# EAGLE design Blinkenlights (EAGLE 6.4)
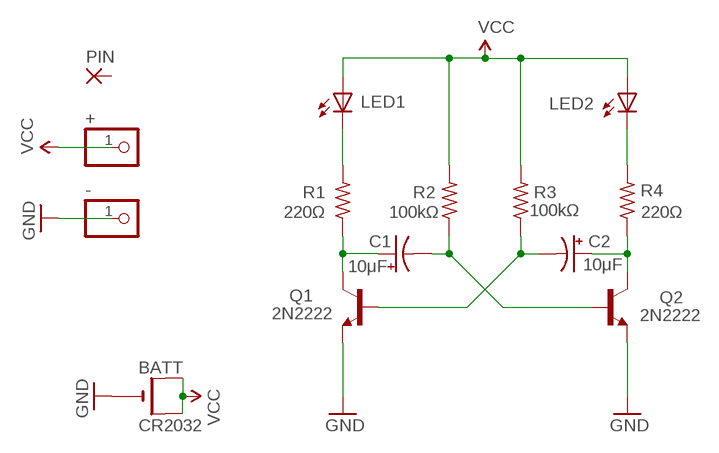
[diagram p0: schematic, sheet 1]

## Parts
+  PINHD-1X1CB  [1X01-CLEANBIG]
-  PINHD-1X1CB  [1X01-CLEANBIG]
BATT  CR2032  CR2032SMT  [CR2032-SMD]
C1  10μF  CAP-POL_E-2.54-05  [E-2.54-05]
C2  10μF  CAP-POL_E-2.54-05  [E-2.54-05]
LED1  LED5MM_BIG  [LED5MM_BIG]
LED2  LED5MM_BIG  [LED5MM_BIG]
PIN  3,17/1,3  [3,17/1,3]
Q1  2N2222  [TO92-EBC-OVAL]
Q2  2N2222  [TO92-EBC-OVAL]
R1  220Ω  RESISTOR-0207/10_BIG  [0207/10_BIG]
R2  100kΩ  RESISTOR-0207/10_BIG  [0207/10_BIG]
R3  100kΩ  RESISTOR-0207/10_BIG  [0207/10_BIG]
R4  220Ω  RESISTOR-0207/10_BIG  [0207/10_BIG]

## Nets
GND: -.1 BATT.- Q1.E Q2.E
N$1: C1.+ Q1.C R1.1
N$2: C2.+ Q2.C R4.1
N$3: C1.- Q2.B R2.1
N$4: C2.- Q1.B R3.1
N$5: LED1.K(C) R1.2
N$6: LED2.K(C) R4.2
VCC: +.1 BATT.+$1(+) BATT.+$2(+1) LED1.A LED2.A R2.2 R3.2
Unconnected: PIN.1(P)

## Library data of the parts
+ - = IXR:PINHD-1X1: Pin header 1x1 for 0.1" spacing With round pins
BATT = adafruit:CR2032
C1 C2 = IXR:CAP-POL: Polarized Capacitor
LED1 LED2 = IXR:LED: LED
PIN = wirepad:3,17/1,3: THROUGH-HOLE PAD
Q1 Q2 = IXR:2N2222: NPN TRANSISTOR Big oval pads
R1-R4 = IXR:RESISTOR: RESISTOR

## Net classes
0 default: width 0.254 mm, clearance 0.254 mm

## Board
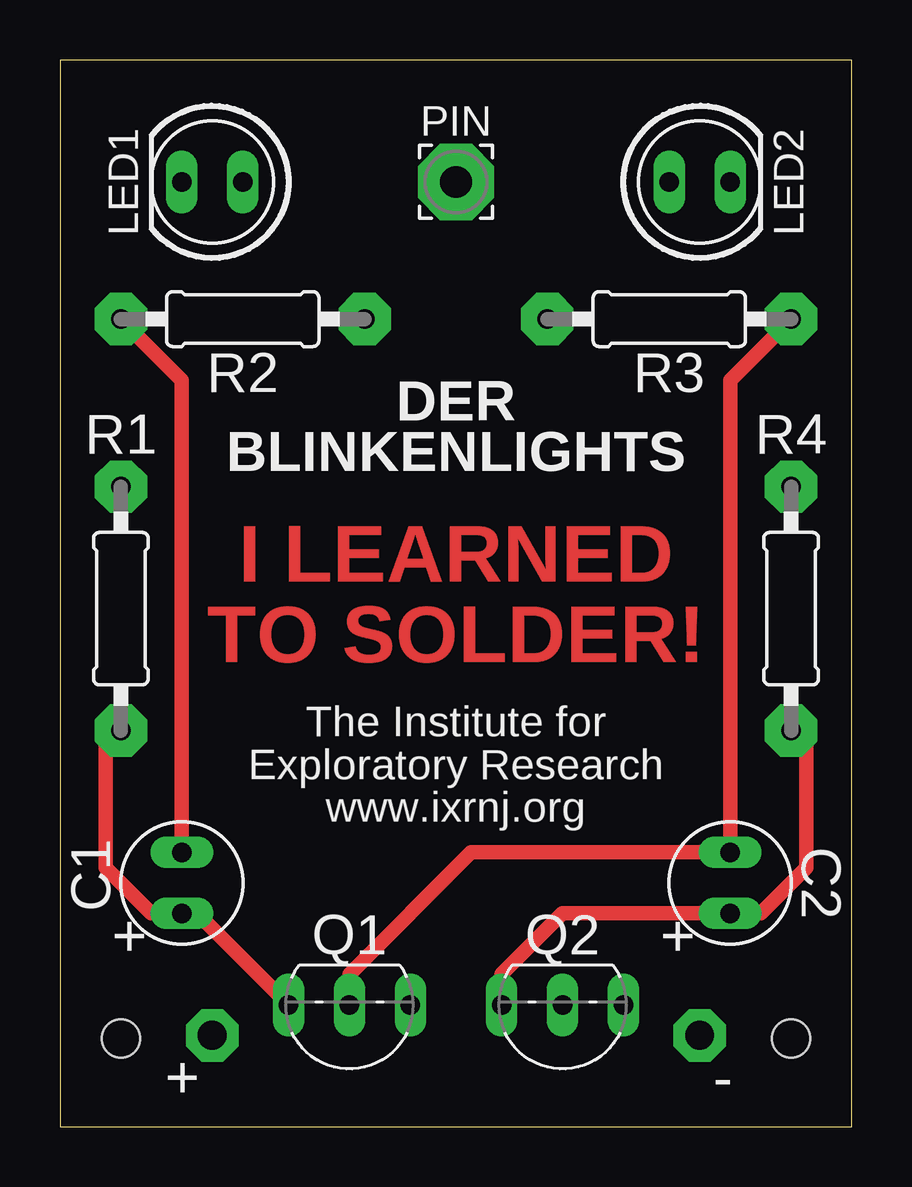
[diagram p1: board, top side]
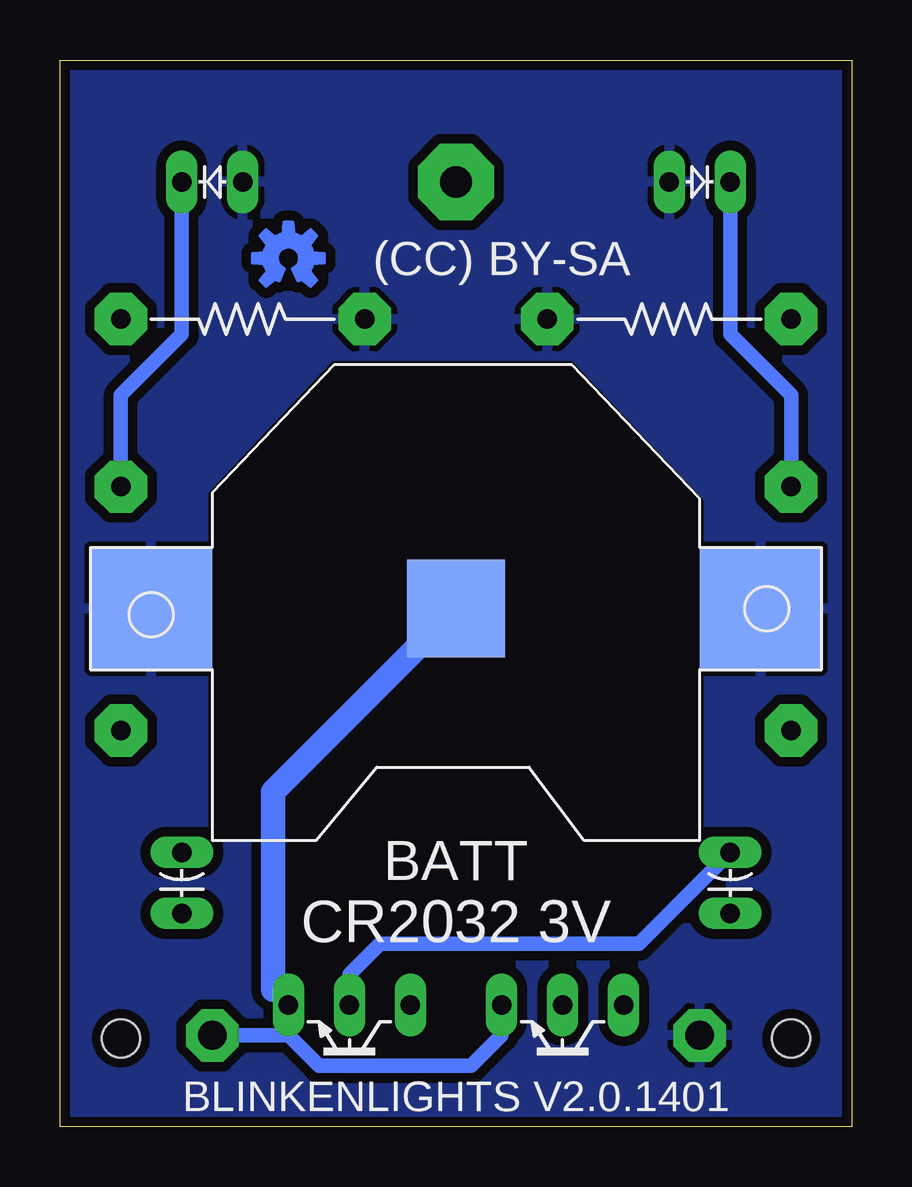
[diagram p2: board, bottom side, seen from below]

Size 33.02 x 44.45 mm. Coordinates in mm from the lower left corner, seen from the top.
Outline: 0,0 33.02,0 33.02,44.45 0,44.45 0,0
Copper layers (1*16): Top 0.035mm / dielectric 1.5mm / Bottom 0.035mm
Design rules "Fusion_eagle_rule_v1.1": minimum track width 6mil, minimum drill 12mil, track to track 6mil, track to pad 6mil, pad to pad 6mil, via to via 6mil, smd to smd 0mil, copper to edge 10mil, drill to drill 10mil, minimum pad ring 10mil, minimum via ring 6mil, stop-mask expansion 2mil, vias tented up to drill 100mil, thermal gap 10mil
Holes 1.6 mm at 2.54,3.68 30.48,3.68

### Footprints (pad centres in the part's own frame; a part is rotated, then mirrored left to right if it is on the bottom)
1X01-CLEANBIG = drill 1.2 pad 2.184 octagon: 1 0,0
CR2032-SMD = smd 5.08 x 5.08: +$1 -12.7,0; +$2 12.7,0 | smd 4.064 x 4.064: - 0,0
E-2.54-05 = drill 0.813 long: + -1.27,0; - 1.27,0
LED5MM_BIG = drill 0.813 long: A -1.27,0; K 1.27,0
3,17/1,3 = drill 1.321 pad 3.175 octagon: 1 0,0
TO92-EBC-OVAL = drill 0.813 long: B 0,-1.27; C 2.54,-1.27; E -2.54,-1.27
0207/10_BIG = drill 0.813 pad 2.184 octagon: 1 -5.08,0; 2 5.08,0

### Placement (x,y rotation side)
+  6.35,3.81 0 top
-  26.67,3.81 0 top
BATT  16.51,21.59 180 bottom
C1  5.08,10.16 90 top
C2  27.94,10.16 90 top
LED1  6.35,39.37 180 top
LED2  26.67,39.37 0 top
PIN  16.51,39.37 0 top
Q1  12.06,3.81 180 top
Q2  20.95,3.81 180 top
R1  2.54,21.59 90 top
R2  7.62,33.66 0 top
R3  25.4,33.66 180 top
R4  30.48,21.59 90 top
U$1  [OSHW-LOGO-S]  23.5,36.2 0 bottom

### Tracks (layer width: path | path; a pad name or v marks a point on that pad's centre or on a via)
GND
  Bottom 0.61: 23.5,3.81 22.23,2.54 15.88,2.54 14.61,3.81 Q1.E | 23.5,3.81 Q2.E 24.13,5.71 | -.1 23.5,3.81
  Bottom 1.016: BATT.- 24.13,13.97 24.13,5.71
N$1
  Top 0.61: Q1.C 5.71,8.89 C1.+ 3.81,8.89 1.91,10.79 1.91,15.88 R1.1
N$2
  Top 0.61: R4.1 31.11,15.88 31.11,10.79 29.21,8.89 C2.+ 20.95,8.89 18.41,6.35 Q2.C
N$3
  Top 0.61: C1.- 5.08,31.11 R2.1
  Bottom 0.61: Q2.B 20.95,6.35 19.68,7.62 8.89,7.62 C1.-
N$4
  Top 0.61: Q1.B 12.06,6.35 17.14,11.43 C2.- 27.94,31.11 R3.1
N$5
  Bottom 0.61: R1.2 2.54,30.48 5.08,33.02 LED1.K
N$6
  Bottom 0.61: R4.2 30.48,30.48 27.94,33.02 LED2.K
N$7
  cutout Bottom: 11.75,31.75 6.35,26.04 6.35,12.06 26.67,12.06 26.67,26.35 21.59,31.75
VCC
  pour Bottom (isolate 0.406): 0,0 0,44.45 33.02,44.45 33.02,0

### Text on the board
Top: I LEARNED / TO SOLDER!
bPlace: (CC) BY-SA | CR2032 3V
tNames: DER / BLINKENLIGHTS | The Institute for / Exploratory Research / www.ixrnj.org
bNames: BLINKENLIGHTS V2.0.1401
tStop: I LEARNED / TO SOLDER!